# Altium project VIOB.PrjPcb
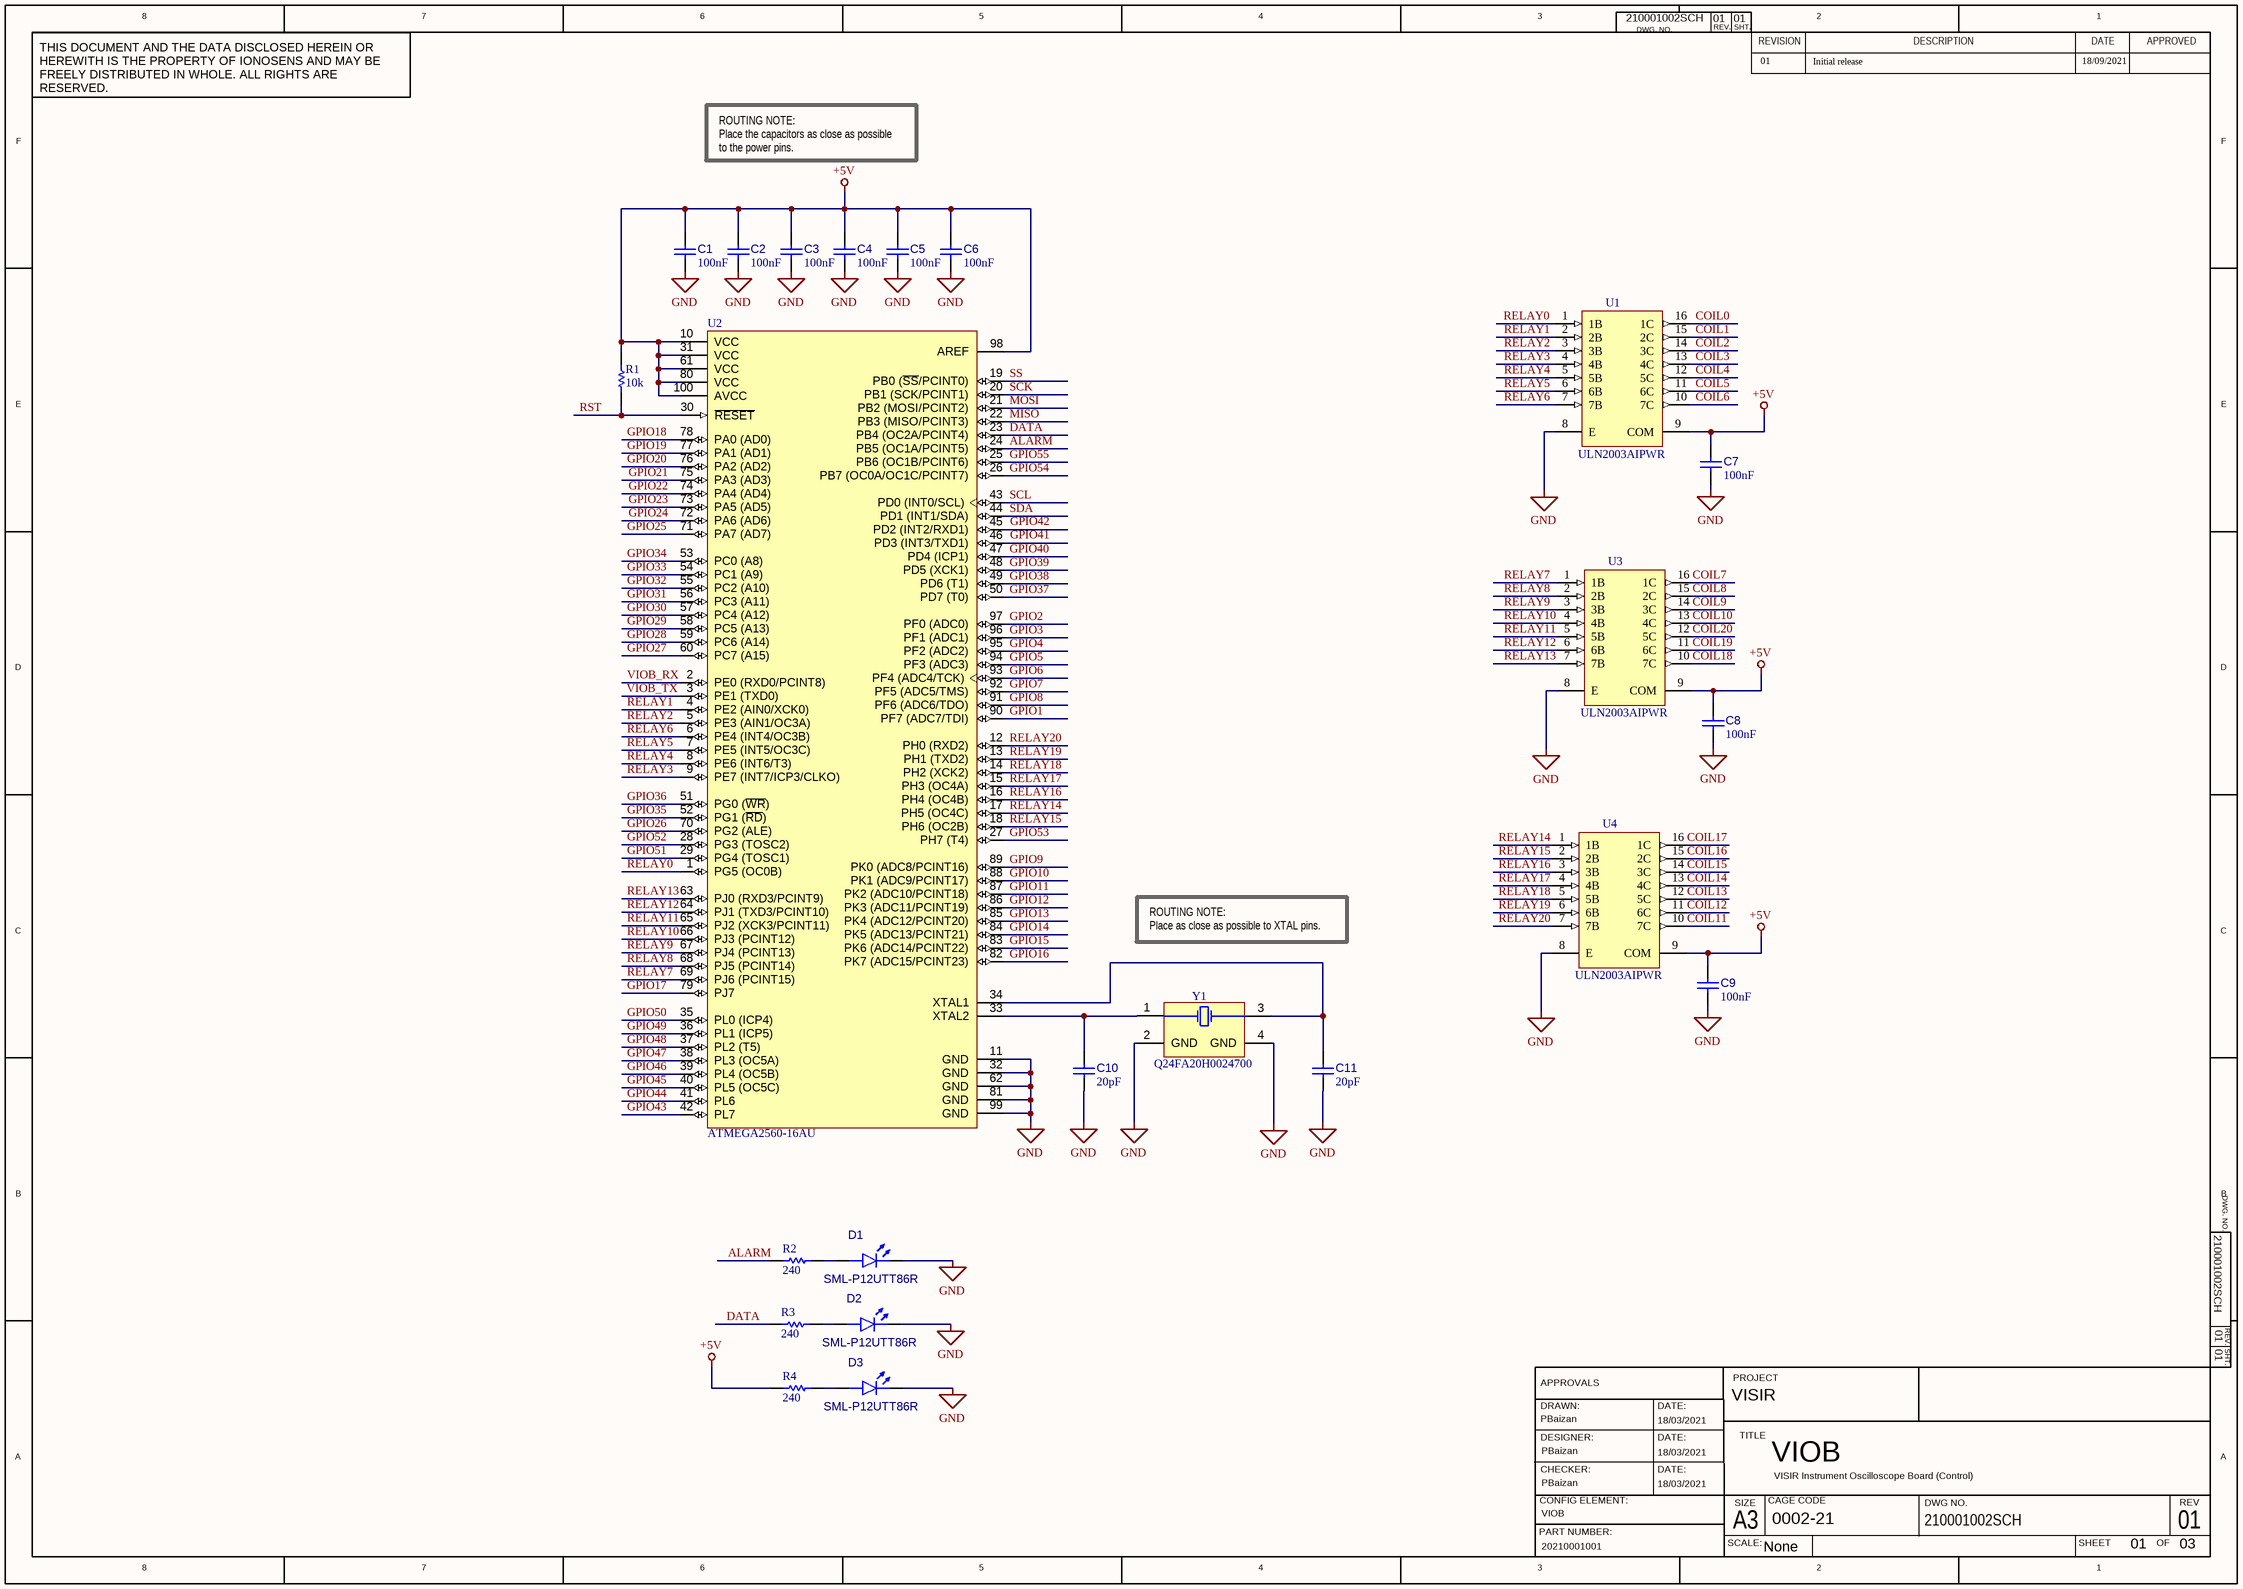
[diagram p0: Sheet1.SchDoc]
3 sheets, 100 parts. Net scope: global (net labels, ports and power ports of the same name join across sheets).
Board file: PCB1.PcbDoc
Sheets:
  Sheet1.SchDoc
  Sheet2.SchDoc
  Sheet3.SchDoc

## Sheet Sheet1.SchDoc: VIOB
size 420 x 297 mm; ApprovedBy: PBaizan; CheckedBy: PBaizan; Author: PBaizan; CompanyName: IONOSENS; DrawnBy: PBaizan; Engineer: PBaizan; Organization: IONOSENS; DocumentNumber: 20210001002SCH; Revision: 01; SheetNumber: 01; SheetTotal: 03; PartNumber: 20210001001; SubTitle: VISIR Instrument Oscilloscope Board (Control); Scale: None; ConfigElement: VIOB; Project: VISIR; ENG_APP_DATE: 18/03/2021; DSN_APP_DATE: 18/03/2021; CHK_APP_DATE: 18/03/2021; CAGE_CODE: 0002-21; DOC_NO_SCH_DWG: 210001002SCH

### Parts
C1  value 100nF  [CAPC1005X06M]  (hidden comment: CC0402JRX7R7BB104)
C2  value 100nF  [CAPC1005X06M]  (hidden comment: CC0402JRX7R7BB104)
C3  value 100nF  [CAPC1005X06M]  (hidden comment: CC0402JRX7R7BB104)
C4  value 100nF  [CAPC1005X06M]  (hidden comment: CC0402JRX7R7BB104)
C5  value 100nF  [CAPC1005X06M]  (hidden comment: CC0402JRX7R7BB104)
C6  value 100nF  [CAPC1005X06M]  (hidden comment: CC0402JRX7R7BB104)
C7  value 100nF  [CAPC1005X06M]  (hidden comment: CC0402JRX7R7BB104)
C8  value 100nF  [CAPC1005X06M]  (hidden comment: CC0402JRX7R7BB104)
C9  value 100nF  [CAPC1005X06M]  (hidden comment: CC0402JRX7R7BB104)
C10  value 20pF  [CAPC1005X06M]  (hidden comment: CC0402JRNPO9BN200)
C11  value 20pF  [CAPC1005X06M]  (hidden comment: CC0402JRNPO9BN200)
D1  SML-P12UTT86R  [DIOC1005X02R]
D2  SML-P12UTT86R  [DIOC1005X02R]
D3  SML-P12UTT86R  [DIOC1005X02R]
R1  value 10k  [RESC1005X04M]  (hidden comment: AC0402FR-0710KL)
R2  value 240  [RESC1005X04M]  (hidden comment: AC0402FR-07240RL)
R3  value 240  [RESC1005X04M]  (hidden comment: AC0402FR-07240RL)
R4  value 240  [RESC1005X04M]  (hidden comment: AC0402FR-07240RL)
U1  ULN2003AIPWR  [TSOP65P640X120-16M]
U2  ATMEGA2560-16AU  [ATML-100A_M]
U3  ULN2003AIPWR  [TSOP65P640X120-16M]
U4  ULN2003AIPWR  [TSOP65P640X120-16M]
Y1  Q24FA20H0024700  [FA-20H]

### Nets
+5V: C1.2 C2.2 C3.2 C4.2 C5.2 C6.2 C7.2 C8.2 C9.2 R1.2 R4.1 U1.9(COM) U2.10(VCC) U2.31(VCC) U2.61(VCC) U2.80(VCC) U2.98(AREF) U2.100(AVCC) U3.9(COM) U4.9(COM)
GND: C1.1 C2.1 C3.1 C4.1 C5.1 C6.1 C7.1 C8.1 C9.1 C10.1 C11.1 D1.1(K) D2.1(K) D3.1(K) U1.8(E) U2.11(GND) U2.32(GND) U2.62(GND) U2.81(GND) U2.99(GND) U3.8(E) U4.8(E) Y1.2(GND) Y1.4(GND)
ALARM: R2.1 U2.24(PB5_(OC1A/PCINT5))
COIL0: U1.16(1C)
COIL1: U1.15(2C)
COIL2: U1.14(3C)
COIL3: U1.13(4C)
COIL4: U1.12(5C)
COIL5: U1.11(6C)
COIL6: U1.10(7C)
COIL7: U3.16(1C)
COIL8: U3.15(2C)
COIL9: U3.14(3C)
COIL10: U3.13(4C)
COIL11: U4.10(7C)
COIL12: U4.11(6C)
COIL13: U4.12(5C)
COIL14: U4.13(4C)
COIL15: U4.14(3C)
COIL16: U4.15(2C)
COIL17: U4.16(1C)
COIL18: U3.10(7C)
COIL19: U3.11(6C)
COIL20: U3.12(5C)
DATA: R3.1 U2.23(PB4_(OC2A/PCINT4))
GPIO1: U2.90(PF7_(ADC7/TDI))
GPIO2: U2.97(PF0_(ADC0))
GPIO3: U2.96(PF1_(ADC1))
GPIO4: U2.95(PF2_(ADC2))
GPIO5: U2.94(PF3_(ADC3))
GPIO6: U2.93(PF4_(ADC4/TCK))
GPIO7: U2.92(PF5_(ADC5/TMS))
GPIO8: U2.91(PF6_(ADC6/TDO))
GPIO9: U2.89(PK0_(ADC8/PCINT16))
GPIO10: U2.88(PK1_(ADC9/PCINT17))
GPIO11: U2.87(PK2_(ADC10/PCINT18))
GPIO12: U2.86(PK3_(ADC11/PCINT19))
GPIO13: U2.85(PK4_(ADC12/PCINT20))
GPIO14: U2.84(PK5_(ADC13/PCINT21))
GPIO15: U2.83(PK6_(ADC14/PCINT22))
GPIO16: U2.82(PK7_(ADC15/PCINT23))
GPIO17: U2.79(PJ7)
GPIO18: U2.78(PA0_(AD0))
GPIO19: U2.77(PA1_(AD1))
GPIO20: U2.76(PA2_(AD2))
GPIO21: U2.75(PA3_(AD3))
GPIO22: U2.74(PA4_(AD4))
GPIO23: U2.73(PA5_(AD5))
GPIO24: U2.72(PA6_(AD6))
GPIO25: U2.71(PA7_(AD7))
GPIO26: U2.70(PG2_(ALE))
GPIO27: U2.60(PC7_(A15))
GPIO28: U2.59(PC6_(A14))
GPIO29: U2.58(PC5_(A13))
GPIO30: U2.57(PC4_(A12))
GPIO31: U2.56(PC3_(A11))
GPIO32: U2.55(PC2_(A10))
GPIO33: U2.54(PC1_(A9))
GPIO34: U2.53(PC0_(A8))
GPIO35: U2.52(PG1_(~{RD}))
GPIO36: U2.51(PG0_(~{WR}))
GPIO37: U2.50(PD7_(T0))
GPIO38: U2.49(PD6_(T1))
GPIO39: U2.48(PD5_(XCK1))
GPIO40: U2.47(PD4_(ICP1))
GPIO41: U2.46(PD3_(INT3/TXD1))
GPIO42: U2.45(PD2_(INT2/RXD1))
GPIO43: U2.42(PL7)
GPIO44: U2.41(PL6)
GPIO45: U2.40(PL5_(OC5C))
GPIO46: U2.39(PL4_(OC5B))
GPIO47: U2.38(PL3_(OC5A))
GPIO48: U2.37(PL2_(T5))
GPIO49: U2.36(PL1_(ICP5))
GPIO50: U2.35(PL0_(ICP4))
GPIO51: U2.29(PG4_(TOSC1))
GPIO52: U2.28(PG3_(TOSC2))
GPIO53: U2.27(PH7_(T4))
GPIO54: U2.26(PB7_(OC0A/OC1C/PCINT7))
GPIO55: U2.25(PB6_(OC1B/PCINT6))
MISO: U2.22(PB3_(MISO/PCINT3))
MOSI: U2.21(PB2_(MOSI/PCINT2))
RELAY0: U1.1(1B) U2.1(PG5_(OC0B))
RELAY1: U1.2(2B) U2.4(PE2_(AIN0/XCK0))
RELAY2: U1.3(3B) U2.5(PE3_(AIN1/OC3A))
RELAY3: U1.4(4B) U2.9(PE7_(INT7/ICP3/CLKO))
RELAY4: U1.5(5B) U2.8(PE6_(INT6/T3))
RELAY5: U1.6(6B) U2.7(PE5_(INT5/OC3C))
RELAY6: U1.7(7B) U2.6(PE4_(INT4/OC3B))
RELAY7: U2.69(PJ6_(PCINT15)) U3.1(1B)
RELAY8: U2.68(PJ5_(PCINT14)) U3.2(2B)
RELAY9: U2.67(PJ4_(PCINT13)) U3.3(3B)
RELAY10: U2.66(PJ3_(PCINT12)) U3.4(4B)
RELAY11: U2.65(PJ2_(XCK3/PCINT11)) U3.5(5B)
RELAY12: U2.64(PJ1_(TXD3/PCINT10)) U3.6(6B)
RELAY13: U2.63(PJ0_(RXD3/PCINT9)) U3.7(7B)
RELAY14: U2.17(PH5_(OC4C)) U4.1(1B)
RELAY15: U2.18(PH6_(OC2B)) U4.2(2B)
RELAY16: U2.16(PH4_(OC4B)) U4.3(3B)
RELAY17: U2.15(PH3_(OC4A)) U4.4(4B)
RELAY18: U2.14(PH2_(XCK2)) U4.5(5B)
RELAY19: U2.13(PH1_(TXD2)) U4.6(6B)
RELAY20: U2.12(PH0_(RXD2)) U4.7(7B)
RST: R1.1 U2.30(~{RESET})
SCK: U2.20(PB1_(SCK/PCINT1))
SCL: U2.43(PD0_(INT0/SCL))
SDA: U2.44(PD1_(INT1/SDA))
SS: U2.19(PB0_(~{SS}/PCINT0))
VIOB_RX: U2.2(PE0_(RXD0/PCINT8))
VIOB_TX: U2.3(PE1_(TXD0))
NetC10_2: C10.2 U2.33(XTAL2) Y1.1(X1)
NetC11_2: C11.2 U2.34(XTAL1) Y1.3(X2)
NetD1_2: D1.2(A) R2.2
NetD2_2: D2.2(A) R3.2
NetD3_2: D3.2(A) R4.2

### Notes on the sheet
- 01
- Initial release
- 18/09/2021
- ROUTING NOTE:
  Place the capacitors as close as possible to the power pins.
- ROUTING NOTE:
  Place as close as possible to XTAL pins.
- 8
- 7
- 6
- 5
- 4
- 3
- DWG. NO.
- REV.
- SHT.
- REVISION
- 2
- DESCRIPTION
- DATE
- 1
- APPROVED
- THIS DOCUMENT AND THE DATA DISCLOSED HEREIN OR HEREWITH IS THE PROPERTY OF IONOSENS AND MAY BE FREELY DISTRIBUTED IN WHOLE. ALL RIGHTS ARE RESERVED.
- F
- E
- D
- C
- B
- DRAWN:
- APPROVALS
- DATE:
- PROJECT
- A
- CHECKER:
- DESIGNER:
- TITLE
- PART NUMBER:
- CONFIG ELEMENT:
- SCALE:
- A3
- SIZE
- CAGE CODE
- DWG NO.
- SHEET
- OF
- REV

### Library data of the parts
C1-C9 = C01-0402-01-00001-1: Cap Ceramic 100nF 50V X7R 5% SMD 0402 125°C; Manufacturer: YAGEO; Voltage Rating: 16V; Case/Package: 0402; Capacitor Type: Ceramic; Min Operating Temperature: -55°C; Width: 508µm; Length: 1mm; Tolerance: 5%; Dielectric: X7R; RoHS Compliant: Yes; Pins: 2; Composition: Ceramic; Depth: 500µm; Voltage Rating (DC): 16V; Mount: Surface Mount; Mounting Technology: Surface Mount; Termination: SMD/SMT; Manufacturer P/N: CC0402JRX7R7BB104; Thickness: 558.8µm; Max Operating Temperature: 125°C
C10 C11 = C01-0402-01-00008-1: Cap Ceramic 20pF 50V C0G 5% SMD 0402 125°C; Manufacturer: YAGEO; Dielectric: COG; Case/Package: 0402; Tolerance: 5%; Thickness: 558.8µm; Termination: SMD/SMT; Manufacturer P/N: CC0402JRNPO9BN200; Voltage Rating: 50V; Length: 990.6µm; Depth: 500µm; Width: 508µm; Min Operating Temperature: -55°C; Mount: Surface Mount; Voltage Rating (DC): 50V; Pins: 2; Capacitor Type: Ceramic; RoHS Compliant: Yes; Composition: Ceramic; Mounting Technology: Surface Mount; Max Operating Temperature: 125°C
D1-D3 = D01-0402-01-00001-1: Led red 0402; Manufacturer: ROHM; Number of LEDs: 1; Max Power Dissipation: 52mW; Luminous Intensity: 85 mcd; Dominant Wavelength: 620 nm; Lens Style: Rectangular, Square; Forward Current: 20 mA; Forward Voltage: 2V; Mounting Technology: SMD; Case/Package: 0402; Min Operating Temperature: -40°C; Max Operating Temperature: 85°C; Manufacturer P/N: SML-P12UTT86R; Colour: red; RoHS Compliant: Yes; Pins: 2
R1 = R01-0402-01-00169-2: RES SMD 10K OHM 1% 1/16W 0402; Manufacturer: Yageo; Temperature Coefficient: 100 ppm/ºC; Power Rating: 62.5mW; Voltage Rating: 50V; Length: 990.6µm; Height: 370µm; Min Operating Temperature: -55°C; Case/Package: 0402; Features: Automotive AEC-Q200, Moisture Resistant; Packaging: Tape & Reel; Width: 508µm; Manufacturer P/N: AC0402FR-0710KL; RoHS: Yes; Max Operating Temperature: 155°C; Tolerance: 1%; Composition: Thick Film; Number of Terminations: 2
R2-R4 = R01-0402-01-00437-2: RES SMD 240 OHM 1% 1/16W 0402; Manufacturer: Yageo; Temperature Coefficient: 100 ppm/ºC; Power Rating: 62.5mW; Voltage Rating: 50V; Packaging: Tape & Reel; Manufacturer P/N: AC0402FR-07240RL; Height: 370µm; Case/Package: 0402; Composition: Thick Film; Max Operating Temperature: 155°C; Number of Terminations: 2; RoHS: Yes; Min Operating Temperature: -55°C; Tolerance: 1%; Width: 508µm; Length: 990.6µm; Features: Automotive AEC-Q200, Moisture Resistant
U1 U3 U4 = CMP-0005-0001-00001-1: 50-V, 7-ch darlington transistor array, -40 to 105C 16-TSSOP -40 to 105; Manufacturer: Texas Instruments; Voltage Rating: 50V; Min Operating Temperature: 105°C; RoHS Compliant: yes; Pins: 16; Case/Package: TSSOP; Mounting Technology: SMD; Length: 5mm; Manufacturer P/N: ULN2003AIPWR; Height: 1.2mm; Max Operating Temperature: -40°C; Width: 4.4mm
U2 = U01-0007-01-00000-1: AVR ATmega Microcontroller 8-bit 16MHz 256KB FLASH TQFP100; Manufacturer: Microchip; Oscillator Type: External; Interface: I2C, SPI, UART; Minimum Supply Voltage: 4.5V; Peripherals: Brown-out Detect/Reset, POR, PWM, WDT; Number of A/D: 1 AD / 16 channels; Watchdog Timer: Yes; Number of I/O: 86; RAM Size: 8KB; Max Supply Voltage: 5.5V; Max Operating Temperature: 85°C; Manufacturer P/N: ATMEGA2560-16AU; Memory Size: 256KB; Mounting Technology: SMD; Memory Type: FLASH; Pins: 100; Height: 1.2mm; Case/Package: A; RoHS: Yes; Min Operating Temperature: -40°C; Max Frequency: 16MHz; Number of Programmable I/O: 86; Contact Plating: Tin; Core Architecture: AVR; Frequency: 16MHz; Width: 16.25mm
Y1 = Y01-0001-01-00000-11: 16MHz ±10ppm 16pF 80Ω SMD-2520_4P; Manufacturer: SEIKO-EPSON; ESR: 80; RoHS Compliant: yes; Min Operating Temperature: -40°C; Load Capacitance: 16pF; Mounting Technology: SMD; Pins: 4; Case/Package: SMD-2520_4P; Max Operating Temperature: 85°C; Frequency: 16MHz; Manufacturer P/N: Q24FA20H0024700

## Sheet Sheet2.SchDoc: VIOB
size 420 x 297 mm; Date: 18/09/2021; ApprovedBy: PBaizan; CheckedBy: PBaizan; Author: PBaizan; CompanyName: IONOSENS; DrawnBy: PBaizan; Engineer: PBaizan; Organization: IONOSENS; DocumentNumber: 20210001002SCH; Revision: 01; SheetNumber: 02; SheetTotal: 03; SubTitle: VISIR Instrument Oscilloscope Board; CAGE_CODE: 0002-21; DOC_NO_SCH_DWG: 210001002SCH; SCH_SCALE: None
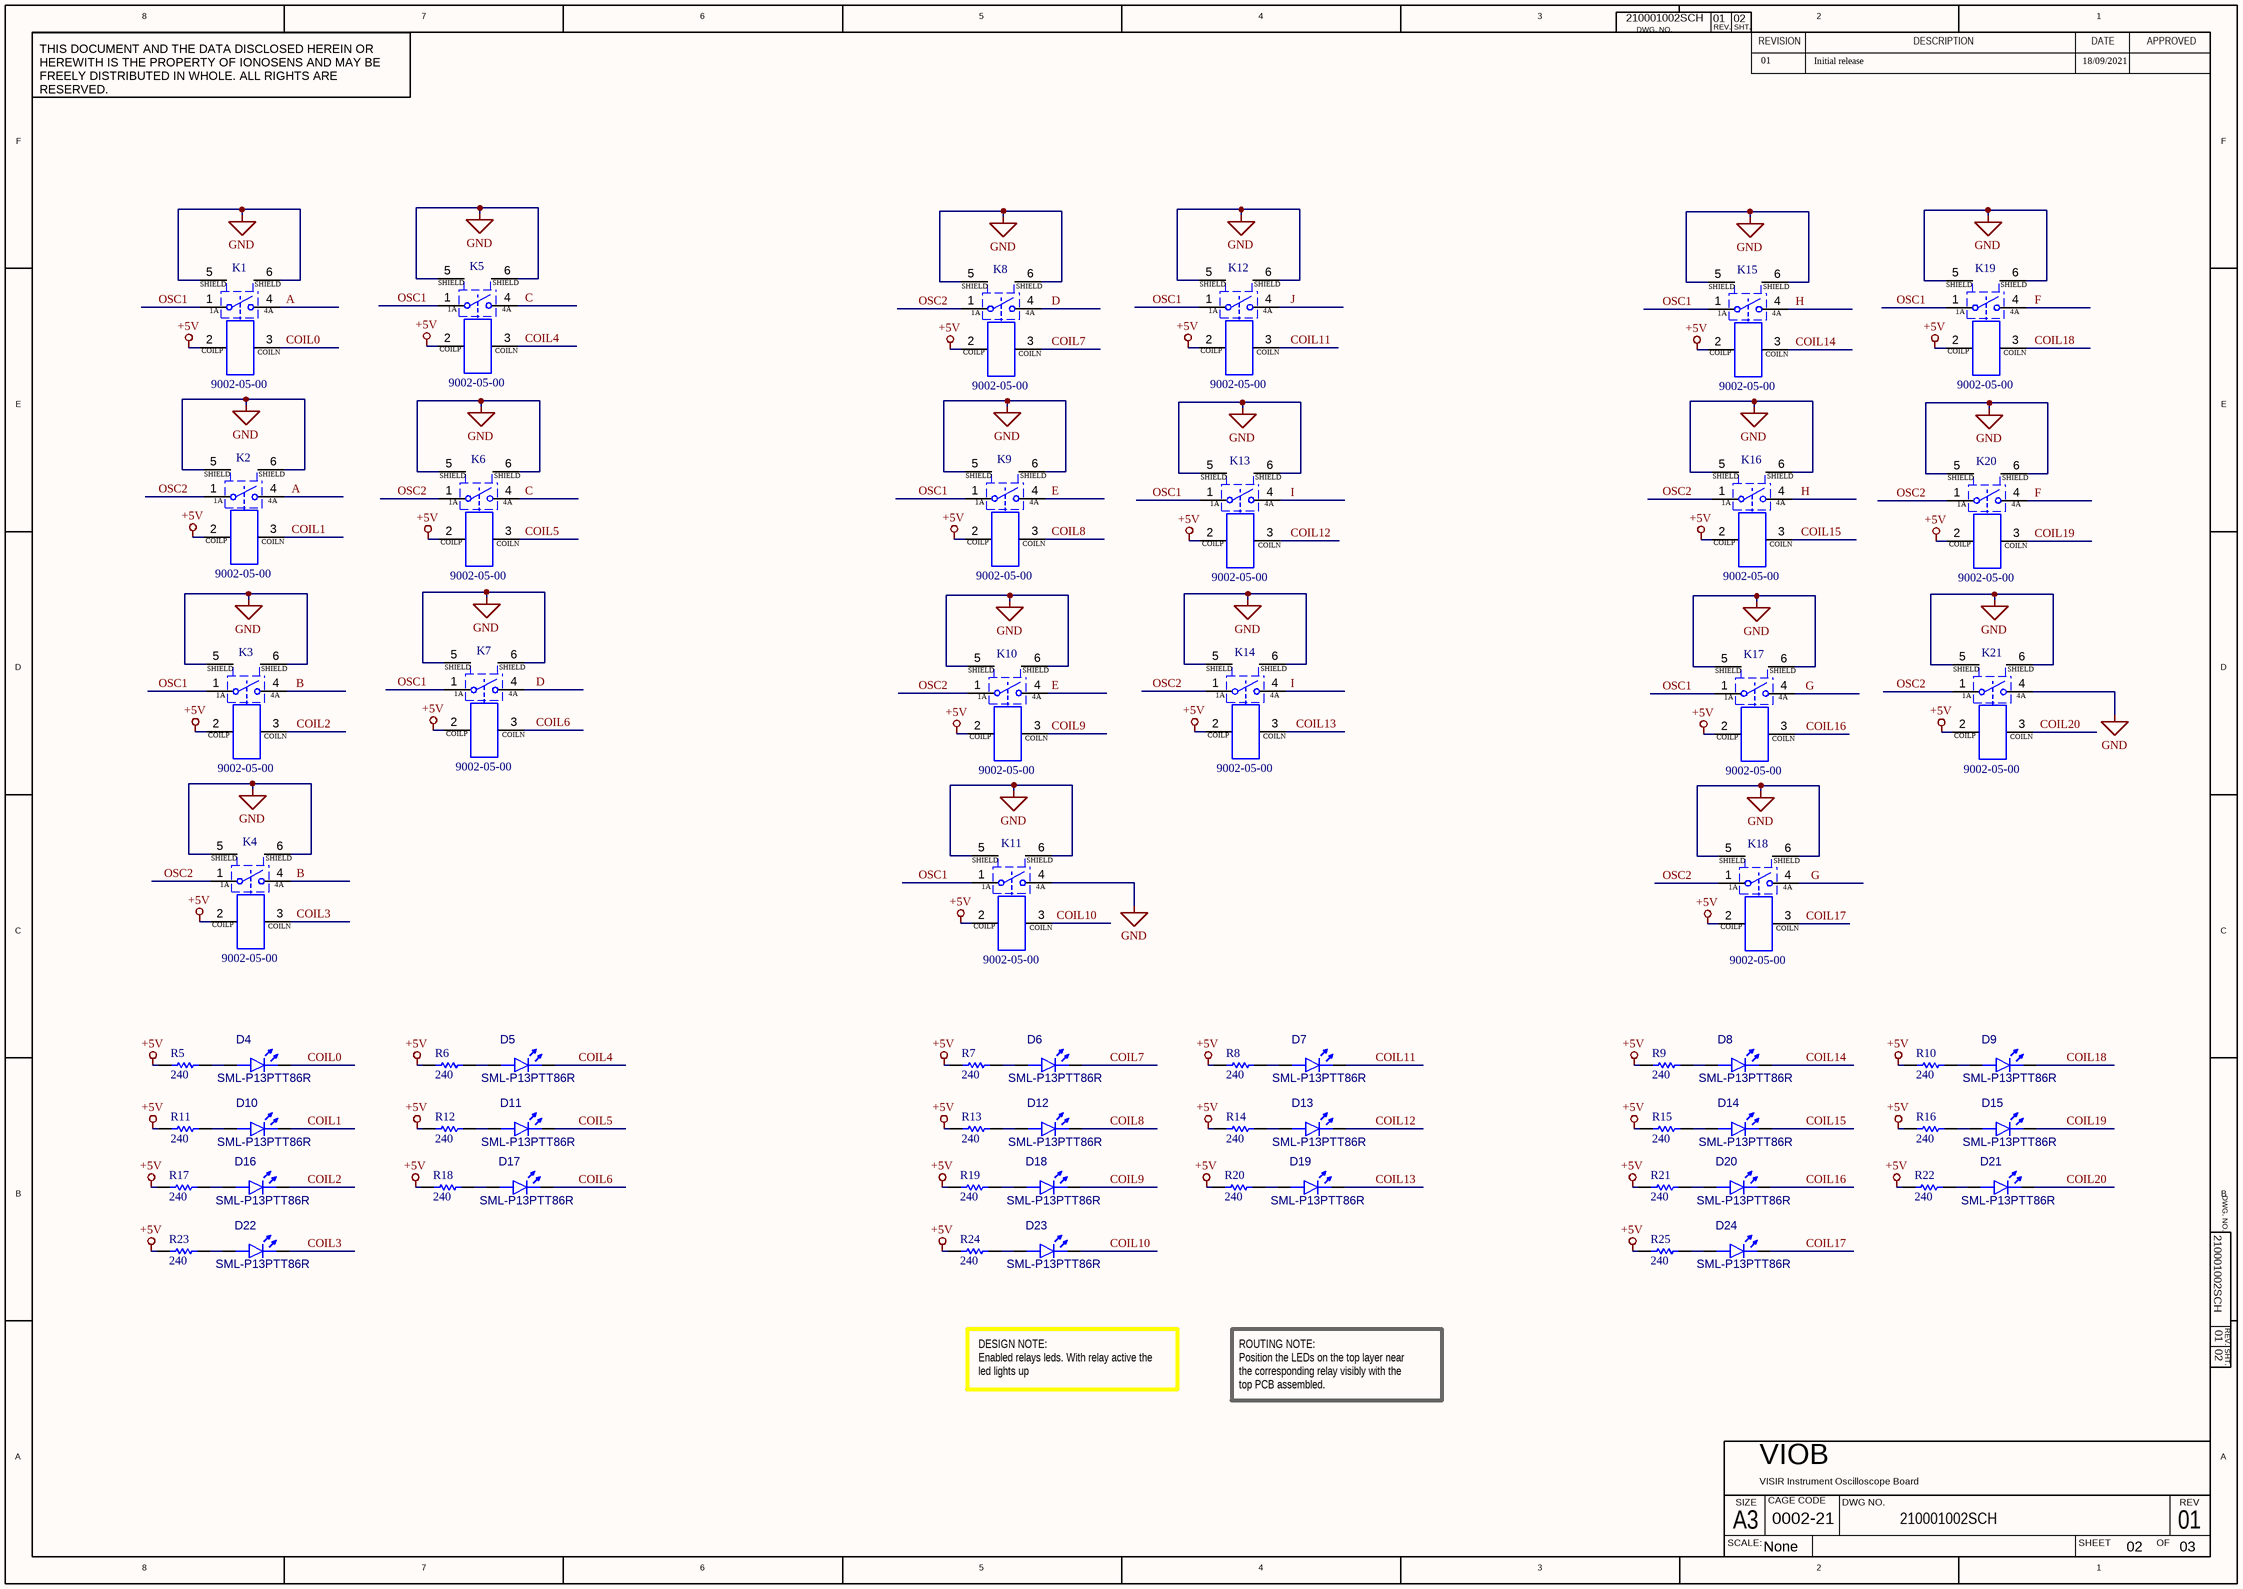
[diagram p1: Sheet2.SchDoc]

### Parts
D4  SML-P13PTT86R  [DIOC1005X02R]
D5  SML-P13PTT86R  [DIOC1005X02R]
D6  SML-P13PTT86R  [DIOC1005X02R]
D7  SML-P13PTT86R  [DIOC1005X02R]
D8  SML-P13PTT86R  [DIOC1005X02R]
D9  SML-P13PTT86R  [DIOC1005X02R]
D10  SML-P13PTT86R  [DIOC1005X02R]
D11  SML-P13PTT86R  [DIOC1005X02R]
D12  SML-P13PTT86R  [DIOC1005X02R]
D13  SML-P13PTT86R  [DIOC1005X02R]
D14  SML-P13PTT86R  [DIOC1005X02R]
D15  SML-P13PTT86R  [DIOC1005X02R]
D16  SML-P13PTT86R  [DIOC1005X02R]
D17  SML-P13PTT86R  [DIOC1005X02R]
D18  SML-P13PTT86R  [DIOC1005X02R]
D19  SML-P13PTT86R  [DIOC1005X02R]
D20  SML-P13PTT86R  [DIOC1005X02R]
D21  SML-P13PTT86R  [DIOC1005X02R]
D22  SML-P13PTT86R  [DIOC1005X02R]
D23  SML-P13PTT86R  [DIOC1005X02R]
D24  SML-P13PTT86R  [DIOC1005X02R]
K1  9002-05-00  [SIP564W40P254L1980H810Q6 - Cloned]
K2  9002-05-00  [SIP564W40P254L1980H810Q6 - Cloned]
K3  9002-05-00  [SIP564W40P254L1980H810Q6 - Cloned]
K4  9002-05-00  [SIP564W40P254L1980H810Q6 - Cloned]
K5  9002-05-00  [SIP564W40P254L1980H810Q6 - Cloned]
K6  9002-05-00  [SIP564W40P254L1980H810Q6 - Cloned]
K7  9002-05-00  [SIP564W40P254L1980H810Q6 - Cloned]
K8  9002-05-00  [SIP564W40P254L1980H810Q6 - Cloned]
K9  9002-05-00  [SIP564W40P254L1980H810Q6 - Cloned]
K10  9002-05-00  [SIP564W40P254L1980H810Q6 - Cloned]
K11  9002-05-00  [SIP564W40P254L1980H810Q6 - Cloned]
K12  9002-05-00  [SIP564W40P254L1980H810Q6 - Cloned]
K13  9002-05-00  [SIP564W40P254L1980H810Q6 - Cloned]
K14  9002-05-00  [SIP564W40P254L1980H810Q6 - Cloned]
K15  9002-05-00  [SIP564W40P254L1980H810Q6 - Cloned]
K16  9002-05-00  [SIP564W40P254L1980H810Q6 - Cloned]
K17  9002-05-00  [SIP564W40P254L1980H810Q6 - Cloned]
K18  9002-05-00  [SIP564W40P254L1980H810Q6 - Cloned]
K19  9002-05-00  [SIP564W40P254L1980H810Q6 - Cloned]
K20  9002-05-00  [SIP564W40P254L1980H810Q6 - Cloned]
K21  9002-05-00  [SIP564W40P254L1980H810Q6 - Cloned]
R5  value 240  [RESC1005X04M]  (hidden comment: AC0402FR-07240RL)
R6  value 240  [RESC1005X04M]  (hidden comment: AC0402FR-07240RL)
R7  value 240  [RESC1005X04M]  (hidden comment: AC0402FR-07240RL)
R8  value 240  [RESC1005X04M]  (hidden comment: AC0402FR-07240RL)
R9  value 240  [RESC1005X04M]  (hidden comment: AC0402FR-07240RL)
R10  value 240  [RESC1005X04M]  (hidden comment: AC0402FR-07240RL)
R11  value 240  [RESC1005X04M]  (hidden comment: AC0402FR-07240RL)
R12  value 240  [RESC1005X04M]  (hidden comment: AC0402FR-07240RL)
R13  value 240  [RESC1005X04M]  (hidden comment: AC0402FR-07240RL)
R14  value 240  [RESC1005X04M]  (hidden comment: AC0402FR-07240RL)
R15  value 240  [RESC1005X04M]  (hidden comment: AC0402FR-07240RL)
R16  value 240  [RESC1005X04M]  (hidden comment: AC0402FR-07240RL)
R17  value 240  [RESC1005X04M]  (hidden comment: AC0402FR-07240RL)
R18  value 240  [RESC1005X04M]  (hidden comment: AC0402FR-07240RL)
R19  value 240  [RESC1005X04M]  (hidden comment: AC0402FR-07240RL)
R20  value 240  [RESC1005X04M]  (hidden comment: AC0402FR-07240RL)
R21  value 240  [RESC1005X04M]  (hidden comment: AC0402FR-07240RL)
R22  value 240  [RESC1005X04M]  (hidden comment: AC0402FR-07240RL)
R23  value 240  [RESC1005X04M]  (hidden comment: AC0402FR-07240RL)
R24  value 240  [RESC1005X04M]  (hidden comment: AC0402FR-07240RL)
R25  value 240  [RESC1005X04M]  (hidden comment: AC0402FR-07240RL)

### Nets
+5V: K1.2(COILP) K2.2(COILP) K3.2(COILP) K4.2(COILP) K5.2(COILP) K6.2(COILP) K7.2(COILP) K8.2(COILP) K9.2(COILP) K10.2(COILP) K11.2(COILP) K12.2(COILP) K13.2(COILP) K14.2(COILP) K15.2(COILP) K16.2(COILP) K17.2(COILP) K18.2(COILP) K19.2(COILP) K20.2(COILP) K21.2(COILP) R5.1 R6.1 R7.1 R8.1 R9.1 R10.1 R11.1 R12.1 R13.1 R14.1 R15.1 R16.1 R17.1 R18.1 R19.1 R20.1 R21.1 R22.1 R23.1 R24.1 R25.1
GND: K1.5(Shield) K1.6(Shield) K2.5(Shield) K2.6(Shield) K3.5(Shield) K3.6(Shield) K4.5(Shield) K4.6(Shield) K5.5(Shield) K5.6(Shield) K6.5(Shield) K6.6(Shield) K7.5(Shield) K7.6(Shield) K8.5(Shield) K8.6(Shield) K9.5(Shield) K9.6(Shield) K10.5(Shield) K10.6(Shield) K11.4(4A) K11.5(Shield) K11.6(Shield) K12.5(Shield) K12.6(Shield) K13.5(Shield) K13.6(Shield) K14.5(Shield) K14.6(Shield) K15.5(Shield) K15.6(Shield) K16.5(Shield) K16.6(Shield) K17.5(Shield) K17.6(Shield) K18.5(Shield) K18.6(Shield) K19.5(Shield) K19.6(Shield) K20.5(Shield) K20.6(Shield) K21.4(4A) K21.5(Shield) K21.6(Shield)
A: K1.4(4A) K2.4(4A)
B: K3.4(4A) K4.4(4A)
C: K5.4(4A) K6.4(4A)
COIL0: D4.1(K) K1.3(COILN)
COIL1: D10.1(K) K2.3(COILN)
COIL2: D16.1(K) K3.3(COILN)
COIL3: D22.1(K) K4.3(COILN)
COIL4: D5.1(K) K5.3(COILN)
COIL5: D11.1(K) K6.3(COILN)
COIL6: D17.1(K) K7.3(COILN)
COIL7: D6.1(K) K8.3(COILN)
COIL8: D12.1(K) K9.3(COILN)
COIL9: D18.1(K) K10.3(COILN)
COIL10: D23.1(K) K11.3(COILN)
COIL11: D7.1(K) K12.3(COILN)
COIL12: D13.1(K) K13.3(COILN)
COIL13: D19.1(K) K14.3(COILN)
COIL14: D8.1(K) K15.3(COILN)
COIL15: D14.1(K) K16.3(COILN)
COIL16: D20.1(K) K17.3(COILN)
COIL17: D24.1(K) K18.3(COILN)
COIL18: D9.1(K) K19.3(COILN)
COIL19: D15.1(K) K20.3(COILN)
COIL20: D21.1(K) K21.3(COILN)
D: K7.4(4A) K8.4(4A)
E: K9.4(4A) K10.4(4A)
F: K19.4(4A) K20.4(4A)
G: K17.4(4A) K18.4(4A)
H: K15.4(4A) K16.4(4A)
I: K13.4(4A) K14.4(4A)
J: K12.4(4A)
OSC1: K1.1(1A) K3.1(1A) K5.1(1A) K7.1(1A) K9.1(1A) K11.1(1A) K12.1(1A) K13.1(1A) K15.1(1A) K17.1(1A) K19.1(1A)
OSC2: K2.1(1A) K4.1(1A) K6.1(1A) K8.1(1A) K10.1(1A) K14.1(1A) K16.1(1A) K18.1(1A) K20.1(1A) K21.1(1A)
NetD4_2: D4.2(A) R5.2
NetD5_2: D5.2(A) R6.2
NetD6_2: D6.2(A) R7.2
NetD7_2: D7.2(A) R8.2
NetD8_2: D8.2(A) R9.2
NetD9_2: D9.2(A) R10.2
NetD10_2: D10.2(A) R11.2
NetD11_2: D11.2(A) R12.2
NetD12_2: D12.2(A) R13.2
NetD13_2: D13.2(A) R14.2
NetD14_2: D14.2(A) R15.2
NetD15_2: D15.2(A) R16.2
NetD16_2: D16.2(A) R17.2
NetD17_2: D17.2(A) R18.2
NetD18_2: D18.2(A) R19.2
NetD19_2: D19.2(A) R20.2
NetD20_2: D20.2(A) R21.2
NetD21_2: D21.2(A) R22.2
NetD22_2: D22.2(A) R23.2
NetD23_2: D23.2(A) R24.2
NetD24_2: D24.2(A) R25.2

### Notes on the sheet
- 01
- Initial release
- 18/09/2021
- DESIGN NOTE:
  Enabled relays leds. With relay active the led lights up
- ROUTING NOTE:
  Position the LEDs on the top layer near the corresponding relay visibly with the top PCB assembled.
- 8
- 7
- 6
- 5
- 4
- 3
- DWG. NO.
- REV.
- SHT.
- REVISION
- 2
- DESCRIPTION
- DATE
- 1
- APPROVED
- THIS DOCUMENT AND THE DATA DISCLOSED HEREIN OR HEREWITH IS THE PROPERTY OF IONOSENS AND MAY BE FREELY DISTRIBUTED IN WHOLE. ALL RIGHTS ARE RESERVED.
- F
- E
- D
- C
- B
- A
- SCALE:
- A3
- SIZE
- CAGE CODE
- DWG NO.
- SHEET
- OF
- REV
- (in symbol K01-0008-01-00002-6) SHIELD

### Library data of the parts
D4-D24 = D01-0402-01-00000-1: Led green 0402; Manufacturer: ROHM; Forward Voltage: 2.1V; Max Power Dissipation: 52mW; Forward Current: 20 mA; Number of LEDs: 1; Dominant Wavelength: 560 nm; Luminous Intensity: 10 mcd; Lens Style: Rectangular, Square; Min Operating Temperature: -40°C; Mounting Technology: SMD; Colour: Green; Manufacturer P/N: SML-P13PTT86R; Max Operating Temperature: 85°C; Pins: 2; RoHS Compliant: Yes; Case/Package: 0402
K1-K21 = K01-0008-01-00002-6: Reed Relay 5VDC 350Ohm 0.5A SPST-NO THT; Manufacturer: COTO; Rise time: 350µs; Coil Current: 14.28mA; Release Time: 100µs; Number of Terminal: 6; Contact Form: SPST; Insulation Resistance: 1T; Coil Type: Non-Latching; Coil Voltage (DC): 5V; Contact Current Rating: 500mA; Contact Resistence: 0.2; Switching Voltage: 200V; Coil resitence: 350; Relay Type: RF; Mounting Technology: Through Hole; Case/Package: SIP; Contact Material: Ruthenium; Packaging: Bulk; Width: 19.3mm; Height: 7.6mm; Max Operating Temperature: 85°C; RoHS: Yes; Min Operating Temperature: -20°C; Pins: 6; Switching Current: 500mA; Operate Time: 350µs; Manufacturer P/N: 9002-05-00
R5-R25 = R01-0402-01-00437-2: as R2 on sheet Sheet1; Packaging: Tape & Reel; Manufacturer P/N: AC0402FR-07240RL; Height: 370µm; Case/Package: 0402; Composition: Thick Film; Max Operating Temperature: 155°C; Number of Terminations: 2; RoHS: Yes; Min Operating Temperature: -55°C; Tolerance: 1%; Width: 508µm; Length: 990.6µm; Features: Automotive AEC-Q200, Moisture Resistant

## Sheet Sheet3.SchDoc: VIOB
size 420 x 297 mm; Date: 18/09/2021; ApprovedBy: PBaizan; CheckedBy: PBaizan; Author: PBaizan; CompanyName: IONOSENS; DrawnBy: PBaizan; Engineer: PBaizan; Organization: IONOSENS; DocumentNumber: 20210001002SCH; Revision: 01; SheetNumber: 03; SheetTotal: 03; SubTitle: VISIR Instrument Oscilloscope Board (Connectors); CAGE_CODE: 0002-21; DOC_NO_SCH_DWG: 210001002SCH; SCH_SCALE: None
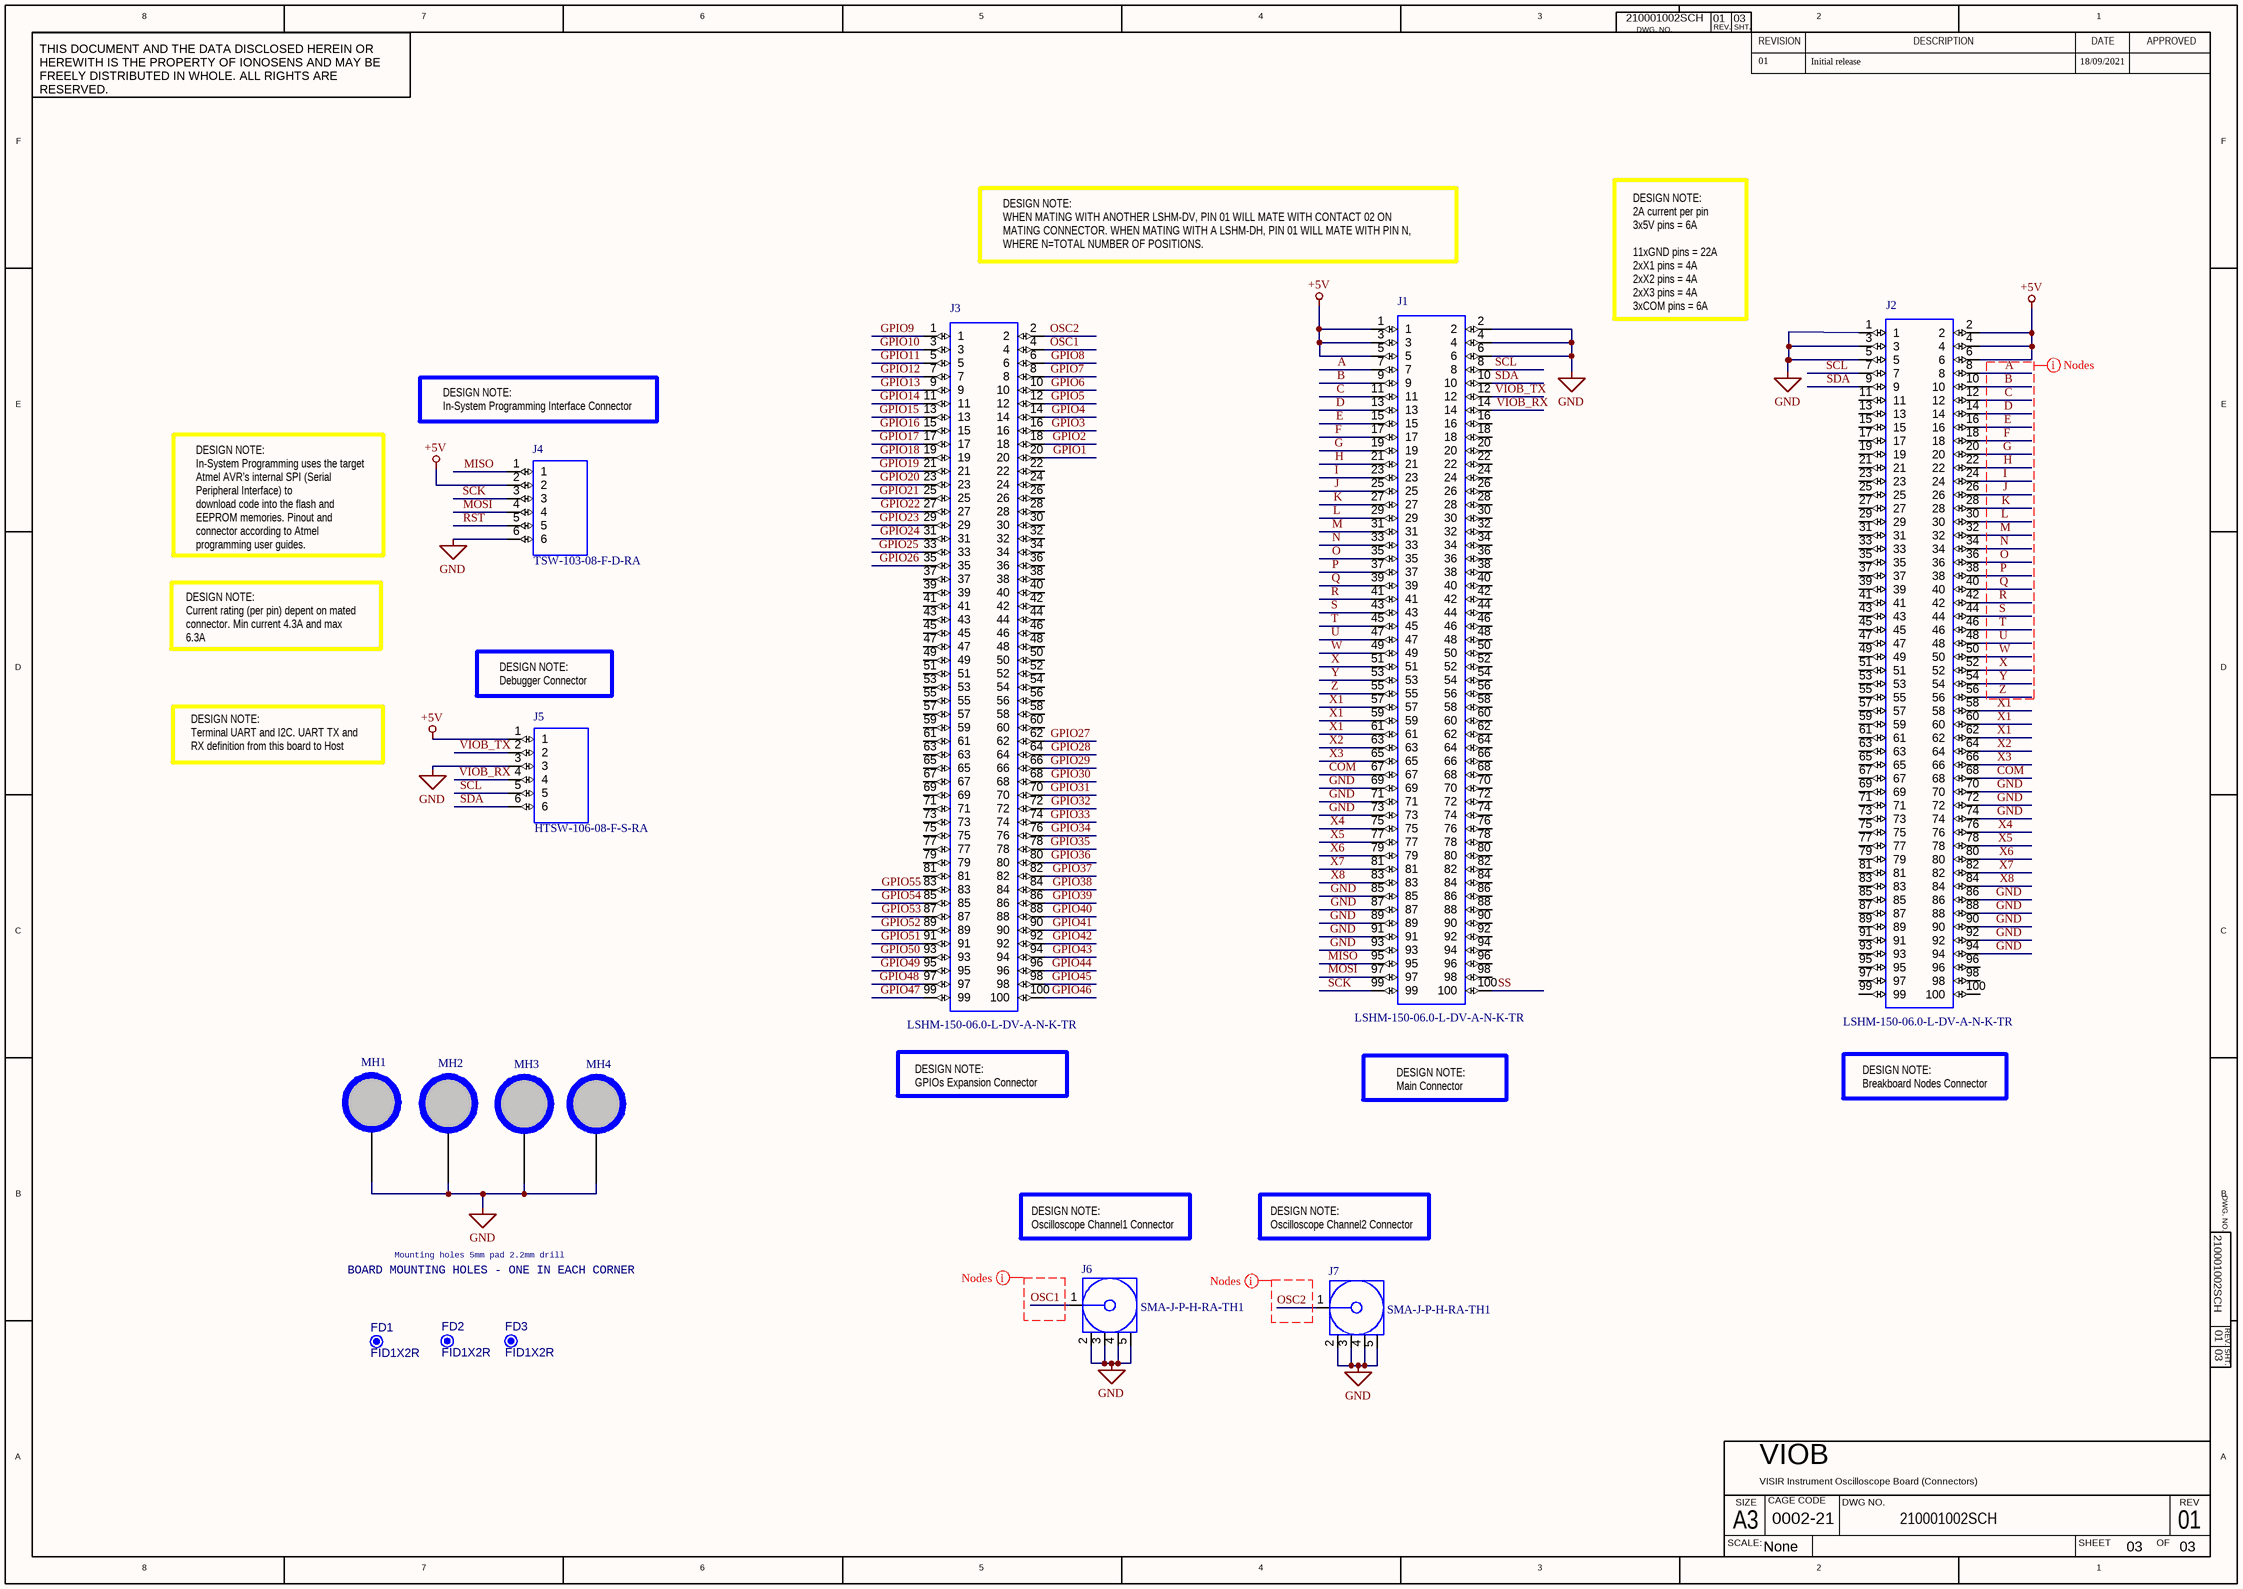
[diagram p2: Sheet3.SchDoc]

### Parts
FD1  FID1X2R  [FID1X2R]  (no BOM)
FD2  FID1X2R  [FID1X2R]  (no BOM)
FD3  FID1X2R  [FID1X2R]  (no BOM)
J1  LSHM-150-06.0-L-DV-A-N-K-TR  [LSHM_150_06_0_L_DV_A_N_K_TR]
J2  LSHM-150-06.0-L-DV-A-N-K-TR  [LSHM_150_06_0_L_DV_A_N_K_TR]
J3  LSHM-150-06.0-L-DV-A-N-K-TR  [LSHM_150_06_0_L_DV_A_N_K_TR]
J4  TSW-103-08-F-D-RA  [TSW-103-08-F-D-RA]
J5  HTSW-106-08-F-S-RA  [TSW-106-08-F-S-RA]
J6  SMA-J-P-H-RA-TH1  [SMA-J-P-H-RA-TH1]
J7  SMA-J-P-H-RA-TH1  [SMA-J-P-H-RA-TH1]
MH1  C500h220  [C500h220z368]  (value not drawn)
MH2  C500h220  [C500h220z368]  (value not drawn)
MH3  C500h220  [C500h220z368]  (value not drawn)
MH4  C500h220  [C500h220z368]  (value not drawn)

### Nets
+5V: J1.1 J1.3 J1.5 J2.2 J2.4 J2.6 J4.2 J5.1
GND: J1.2 J1.4 J1.6 J1.69 J1.71 J1.73 J1.85 J1.87 J1.89 J1.91 J1.93 J2.1 J2.3 J2.5 J2.70 J2.72 J2.74 J2.86 J2.88 J2.90 J2.92 J2.94 J4.6 J5.3 J6.2 J6.3 J6.4 J6.5 J7.2 J7.3 J7.4 J7.5 MH1.1 MH2.1 MH3.1 MH4.1
A: J1.7 J2.8
B: J1.9 J2.10
C: J1.11 J2.12
COM: J1.67 J2.68
D: J1.13 J2.14
E: J1.15 J2.16
F: J1.17 J2.18
G: J1.19 J2.20
GPIO1: J3.20
GPIO2: J3.18
GPIO3: J3.16
GPIO4: J3.14
GPIO5: J3.12
GPIO6: J3.10
GPIO7: J3.8
GPIO8: J3.6
GPIO9: J3.1
GPIO10: J3.3
GPIO11: J3.5
GPIO12: J3.7
GPIO13: J3.9
GPIO14: J3.11
GPIO15: J3.13
GPIO16: J3.15
GPIO17: J3.17
GPIO18: J3.19
GPIO19: J3.21
GPIO20: J3.23
GPIO21: J3.25
GPIO22: J3.27
GPIO23: J3.29
GPIO24: J3.31
GPIO25: J3.33
GPIO26: J3.35
GPIO27: J3.62
GPIO28: J3.64
GPIO29: J3.66
GPIO30: J3.68
GPIO31: J3.70
GPIO32: J3.72
GPIO33: J3.74
GPIO34: J3.76
GPIO35: J3.78
GPIO36: J3.80
GPIO37: J3.82
GPIO38: J3.84
GPIO39: J3.86
GPIO40: J3.88
GPIO41: J3.90
GPIO42: J3.92
GPIO43: J3.94
GPIO44: J3.96
GPIO45: J3.98
GPIO46: J3.100
GPIO47: J3.99
GPIO48: J3.97
GPIO49: J3.95
GPIO50: J3.93
GPIO51: J3.91
GPIO52: J3.89
GPIO53: J3.87
GPIO54: J3.85
GPIO55: J3.83
H: J1.21 J2.22
I: J1.23 J2.24
J: J1.25 J2.26
K: J1.27 J2.28
L: J1.29 J2.30
M: J1.31 J2.32
MISO: J1.95 J4.1
MOSI: J1.97 J4.4
N: J1.33 J2.34
O: J1.35 J2.36
OSC1: J3.4 J6.1
OSC2: J3.2 J7.1
P: J1.37 J2.38
Q: J1.39 J2.40
R: J1.41 J2.42
RST: J4.5
S: J1.43 J2.44
SCK: J1.99 J4.3
SCL: J1.8 J2.7 J5.5
SDA: J1.10 J2.9 J5.6
SS: J1.100
T: J1.45 J2.46
U: J1.47 J2.48
VIOB_RX: J1.14 J5.4
VIOB_TX: J1.12 J5.2
W: J1.49 J2.50
X: J1.51 J2.52
X1: J1.57 J1.59 J1.61 J2.58 J2.60 J2.62
X2: J1.63 J2.64
X3: J1.65 J2.66
X4: J1.75 J2.76
X5: J1.77 J2.78
X6: J1.79 J2.80
X7: J1.81 J2.82
X8: J1.83 J2.84
Y: J1.53 J2.54
Z: J1.55 J2.56

Not connected (* = marked no-connect by the designer): J1 16 18 20 22 24 26 28 30 32 34 36 38 40 42 44 46 48 50 52 54 56 58 60 62 64 66 68 70 72 74 76 78 80 82 84 86 88 90 92 94 96 98; J2 11 13 15 17 19 21 23 25 27 29 31 33 35 37 39 41 43 45 47 49 51 53 55 57 59 61 63 65 67 69 71 73 75 77 79 81 83 85 87 89 91 93 95 96 97 98 99 100; J3 22 24 26 28 30 32 34 36 37 38 39 40 41 42 43 44 45 46 47 48 49 50 51 52 53 54 55 56 57 58 59 60 61 63 65 67 69 71 73 75 77 79 81

### Layout directives
net class Nodes: A, B, C, D, E, F, G, H, I, J, K, L, M, N, O, P, Q, R, S, T, U, W, X, Y, Z
mark named Nodes: OSC1, OSC2

### Notes on the sheet
- 01
- Initial release
- 18/09/2021
- DESIGN NOTE:
  WHEN MATING WITH ANOTHER LSHM-DV, PIN 01 WILL MATE WITH CONTACT 02 ON
  MATING CONNECTOR. WHEN MATING WITH A LSHM-DH, PIN 01 WILL MATE WITH PIN N,
  WHERE N=TOTAL NUMBER OF POSITIONS.
- DESIGN NOTE:
  2A current per pin
  3x5V pins = 6A
  11xGND pins = 22A
  2xX1 pins = 4A
  2xX2 pins = 4A
  2xX3 pins = 4A
  3xCOM pins = 6A
- DESIGN NOTE:
  In-System Programming Interface Connector
- DESIGN NOTE:
  In-System Programming uses the target Atmel AVR’s internal SPI (Serial Peripheral Interface) to
  download code into the flash and EEPROM memories. Pinout and connector according to Atmel programming user guides.
- DESIGN NOTE:
  Current rating (per pin) depent on mated connector. Min current 4.3A and max 6.3A
- (near J5) DESIGN NOTE:
  Debugger Connector
- DESIGN NOTE:
  Terminal UART and I2C. UART TX and RX definition from this board to Host
- DESIGN NOTE:
  GPIOs Expansion Connector
- DESIGN NOTE:
  Main Connector
- DESIGN NOTE:
  Breakboard Nodes Connector
- BOARD MOUNTING HOLES - ONE IN EACH CORNER
- Mounting holes 5mm pad 2.2mm drill
- DESIGN NOTE:
  Oscilloscope Channel1 Connector
- DESIGN NOTE:
  Oscilloscope Channel2 Connector
- 8
- 7
- 6
- 5
- 4
- 3
- DWG. NO.
- REV.
- SHT.
- REVISION
- 2
- DESCRIPTION
- DATE
- 1
- APPROVED
- THIS DOCUMENT AND THE DATA DISCLOSED HEREIN OR HEREWITH IS THE PROPERTY OF IONOSENS AND MAY BE FREELY DISTRIBUTED IN WHOLE. ALL RIGHTS ARE RESERVED.
- F
- E
- D
- C
- B
- A
- SCALE:
- A3
- SIZE
- CAGE CODE
- DWG NO.
- SHEET
- OF
- REV

### Library data of the parts
FD1-FD3 = CMP-00028-00005-2: Fiducial - Round 1x2mm; Pins: 0
J1-J3 = J01-001-01-00001-2: Conn Socket and Terminal Strip HDR/SKT 100 POS 0.5mm Solder ST SMD T/R; Manufacturer: Samtec; Gender: HERMAPHRODITIC; Pitch: 500 µm; Contact Plating: Gold; Case/Package: SMD; Max Operating Temperature: 125°C; Number of Rows: 2; RoHS Compliant: Yes; Housing Color: Black; Mounting Technology: SMD; Pins: 100; Termination: Solder; Orientation: Straight; Depth: 4.98 mm; Length: 29.7 mm; Contact Material: Bronze; Housing Material: Polymer; Min Operating Temperature: -55°C; Manufacturer P/N: LSHM-150-06.0-L-DV-A-N-K-TR
J4 = J01-001-01-00003-2: 6 Vias Pin Header 2.54mm, Right Angle; Manufacturer: Samtec; Gender: Male; Orientation: Straight; Mounting Technology: Through Hole; Contact Material: Bronze; Housing Material: Polyester; Pitch: 2.54mm; Housing Color: Black; Termination: Solder; Min Operating Temperature: -55°C; Pins: 6; Depth: 4.87 mm; RoHS Compliant: Yes; Manufacturer P/N: TSW-103-08-F-D-RA; Length: 7.62 mm; Contact Plating: Gold; Number of Rows: 2; Max Operating Temperature: 125°C; Case/Package: Through Hole
J5 = J01-001-01-00005-2: 6 Vias Pin Header 2.54mm, Right Angle, 1 Row; Manufacturer: Samtec; Gender: Male; Mounting Technology: Through Hole; RoHS Compliant: Yes; Contact Plating: Gold; Max Operating Temperature: 125°C; Pins: 6; Housing Material: Polyester; Case/Package: Through Hole; Pitch: 2.54mm; Contact Material: Bronze; Length: 7.62 mm; Termination: Solder; Number of Rows: 2; Manufacturer P/N: HTSW-106-08-F-S-RA; Depth: 4.87 mm; Orientation: Straight; Min Operating Temperature: -55°C; Housing Color: Black
J6 J7 = J01-001-01-00009-2: Conn SMA RCP 0Hz to 18GHz 50Ohm Solder RA Thru-Hole Gold; Manufacturer: Samtec; Pitch: 0; Gender: Female; Contact Material: Copper, Gold; RoHS Compliant: Yes; Termination: solder; Min Operating Temperature: -65°C; Number of Rows: 1; Manufacturer P/N: SMA-J-P-H-RA-TH1; Housing Material: Copper, Gold; Mounting Technology: TH; Case/Package: TH; Orientation: Right angle; Length: 15.1mm; Depth: 7mm; Housing Color: Gold; Max Operating Temperature: 125°C; Pins: 5; Contact Plating: Gold
MH1-MH4 = CMP-00028-00007-2: hole 5mm pad drill 2.2; Manufacturer: Ionosens; Manufacturer P/N: H5D22; Mounting Technology: Pad; RoHS Compliant: yes; Case/Package: Pad; Min Operating Temperature: 125°C; Pins: 1; Max Operating Temperature: -40°C

## Nets that join several sheets
+5V: Sheet1 (20 pins), Sheet2 (42 pins), Sheet3 (8 pins)
GND: Sheet1 (24 pins), Sheet2 (44 pins), Sheet3 (36 pins)
A: Sheet2 (K1.4 K2.4), Sheet3 (J1.7 J2.8)
B: Sheet2 (K3.4 K4.4), Sheet3 (J1.9 J2.10)
C: Sheet2 (K5.4 K6.4), Sheet3 (J1.11 J2.12)
COIL0: Sheet1 (U1.16), Sheet2 (D4.1 K1.3)
COIL1: Sheet1 (U1.15), Sheet2 (D10.1 K2.3)
COIL2: Sheet1 (U1.14), Sheet2 (D16.1 K3.3)
COIL3: Sheet1 (U1.13), Sheet2 (D22.1 K4.3)
COIL4: Sheet1 (U1.12), Sheet2 (D5.1 K5.3)
COIL5: Sheet1 (U1.11), Sheet2 (D11.1 K6.3)
COIL6: Sheet1 (U1.10), Sheet2 (D17.1 K7.3)
COIL7: Sheet1 (U3.16), Sheet2 (D6.1 K8.3)
COIL8: Sheet1 (U3.15), Sheet2 (D12.1 K9.3)
COIL9: Sheet1 (U3.14), Sheet2 (D18.1 K10.3)
COIL10: Sheet1 (U3.13), Sheet2 (D23.1 K11.3)
COIL11: Sheet1 (U4.10), Sheet2 (D7.1 K12.3)
COIL12: Sheet1 (U4.11), Sheet2 (D13.1 K13.3)
COIL13: Sheet1 (U4.12), Sheet2 (D19.1 K14.3)
COIL14: Sheet1 (U4.13), Sheet2 (D8.1 K15.3)
COIL15: Sheet1 (U4.14), Sheet2 (D14.1 K16.3)
COIL16: Sheet1 (U4.15), Sheet2 (D20.1 K17.3)
COIL17: Sheet1 (U4.16), Sheet2 (D24.1 K18.3)
COIL18: Sheet1 (U3.10), Sheet2 (D9.1 K19.3)
COIL19: Sheet1 (U3.11), Sheet2 (D15.1 K20.3)
COIL20: Sheet1 (U3.12), Sheet2 (D21.1 K21.3)
D: Sheet2 (K7.4 K8.4), Sheet3 (J1.13 J2.14)
E: Sheet2 (K9.4 K10.4), Sheet3 (J1.15 J2.16)
F: Sheet2 (K19.4 K20.4), Sheet3 (J1.17 J2.18)
G: Sheet2 (K17.4 K18.4), Sheet3 (J1.19 J2.20)
GPIO1: Sheet1 (U2.90), Sheet3 (J3.20)
GPIO2: Sheet1 (U2.97), Sheet3 (J3.18)
GPIO3: Sheet1 (U2.96), Sheet3 (J3.16)
GPIO4: Sheet1 (U2.95), Sheet3 (J3.14)
GPIO5: Sheet1 (U2.94), Sheet3 (J3.12)
GPIO6: Sheet1 (U2.93), Sheet3 (J3.10)
GPIO7: Sheet1 (U2.92), Sheet3 (J3.8)
GPIO8: Sheet1 (U2.91), Sheet3 (J3.6)
GPIO9: Sheet1 (U2.89), Sheet3 (J3.1)
GPIO10: Sheet1 (U2.88), Sheet3 (J3.3)
GPIO11: Sheet1 (U2.87), Sheet3 (J3.5)
GPIO12: Sheet1 (U2.86), Sheet3 (J3.7)
GPIO13: Sheet1 (U2.85), Sheet3 (J3.9)
GPIO14: Sheet1 (U2.84), Sheet3 (J3.11)
GPIO15: Sheet1 (U2.83), Sheet3 (J3.13)
GPIO16: Sheet1 (U2.82), Sheet3 (J3.15)
GPIO17: Sheet1 (U2.79), Sheet3 (J3.17)
GPIO18: Sheet1 (U2.78), Sheet3 (J3.19)
GPIO19: Sheet1 (U2.77), Sheet3 (J3.21)
GPIO20: Sheet1 (U2.76), Sheet3 (J3.23)
GPIO21: Sheet1 (U2.75), Sheet3 (J3.25)
GPIO22: Sheet1 (U2.74), Sheet3 (J3.27)
GPIO23: Sheet1 (U2.73), Sheet3 (J3.29)
GPIO24: Sheet1 (U2.72), Sheet3 (J3.31)
GPIO25: Sheet1 (U2.71), Sheet3 (J3.33)
GPIO26: Sheet1 (U2.70), Sheet3 (J3.35)
GPIO27: Sheet1 (U2.60), Sheet3 (J3.62)
GPIO28: Sheet1 (U2.59), Sheet3 (J3.64)
GPIO29: Sheet1 (U2.58), Sheet3 (J3.66)
GPIO30: Sheet1 (U2.57), Sheet3 (J3.68)
GPIO31: Sheet1 (U2.56), Sheet3 (J3.70)
GPIO32: Sheet1 (U2.55), Sheet3 (J3.72)
GPIO33: Sheet1 (U2.54), Sheet3 (J3.74)
GPIO34: Sheet1 (U2.53), Sheet3 (J3.76)
GPIO35: Sheet1 (U2.52), Sheet3 (J3.78)
GPIO36: Sheet1 (U2.51), Sheet3 (J3.80)
GPIO37: Sheet1 (U2.50), Sheet3 (J3.82)
GPIO38: Sheet1 (U2.49), Sheet3 (J3.84)
GPIO39: Sheet1 (U2.48), Sheet3 (J3.86)
GPIO40: Sheet1 (U2.47), Sheet3 (J3.88)
GPIO41: Sheet1 (U2.46), Sheet3 (J3.90)
GPIO42: Sheet1 (U2.45), Sheet3 (J3.92)
GPIO43: Sheet1 (U2.42), Sheet3 (J3.94)
GPIO44: Sheet1 (U2.41), Sheet3 (J3.96)
GPIO45: Sheet1 (U2.40), Sheet3 (J3.98)
GPIO46: Sheet1 (U2.39), Sheet3 (J3.100)
GPIO47: Sheet1 (U2.38), Sheet3 (J3.99)
GPIO48: Sheet1 (U2.37), Sheet3 (J3.97)
GPIO49: Sheet1 (U2.36), Sheet3 (J3.95)
GPIO50: Sheet1 (U2.35), Sheet3 (J3.93)
GPIO51: Sheet1 (U2.29), Sheet3 (J3.91)
GPIO52: Sheet1 (U2.28), Sheet3 (J3.89)
GPIO53: Sheet1 (U2.27), Sheet3 (J3.87)
GPIO54: Sheet1 (U2.26), Sheet3 (J3.85)
GPIO55: Sheet1 (U2.25), Sheet3 (J3.83)
H: Sheet2 (K15.4 K16.4), Sheet3 (J1.21 J2.22)
I: Sheet2 (K13.4 K14.4), Sheet3 (J1.23 J2.24)
J: Sheet2 (K12.4), Sheet3 (J1.25 J2.26)
MISO: Sheet1 (U2.22), Sheet3 (J1.95 J4.1)
MOSI: Sheet1 (U2.21), Sheet3 (J1.97 J4.4)
OSC1: Sheet2 (11 pins), Sheet3 (J3.4 J6.1)
OSC2: Sheet2 (10 pins), Sheet3 (J3.2 J7.1)
RST: Sheet1 (R1.1 U2.30), Sheet3 (J4.5)
SCK: Sheet1 (U2.20), Sheet3 (J1.99 J4.3)
SCL: Sheet1 (U2.43), Sheet3 (J1.8 J2.7 J5.5)
SDA: Sheet1 (U2.44), Sheet3 (J1.10 J2.9 J5.6)
SS: Sheet1 (U2.19), Sheet3 (J1.100)
VIOB_RX: Sheet1 (U2.2), Sheet3 (J1.14 J5.4)
VIOB_TX: Sheet1 (U2.3), Sheet3 (J1.12 J5.2)